# Altium schematic sheet breeze_design_template.SchDoc: Breeze Quadcopter
size A4; Organization: Team MicroDynamics; Address1: NWPU; Address2: Xi'an; Address3: Shaanxi; Address4: China; Revision: V0.0
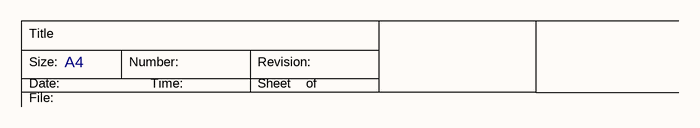
[diagram p0: breeze_design_template.SchDoc]

## Notes on the sheet
- Title
- Size:
- Date:
- A4
- Number:
- Time:
- Revision:
- Sheet
- of
- File: